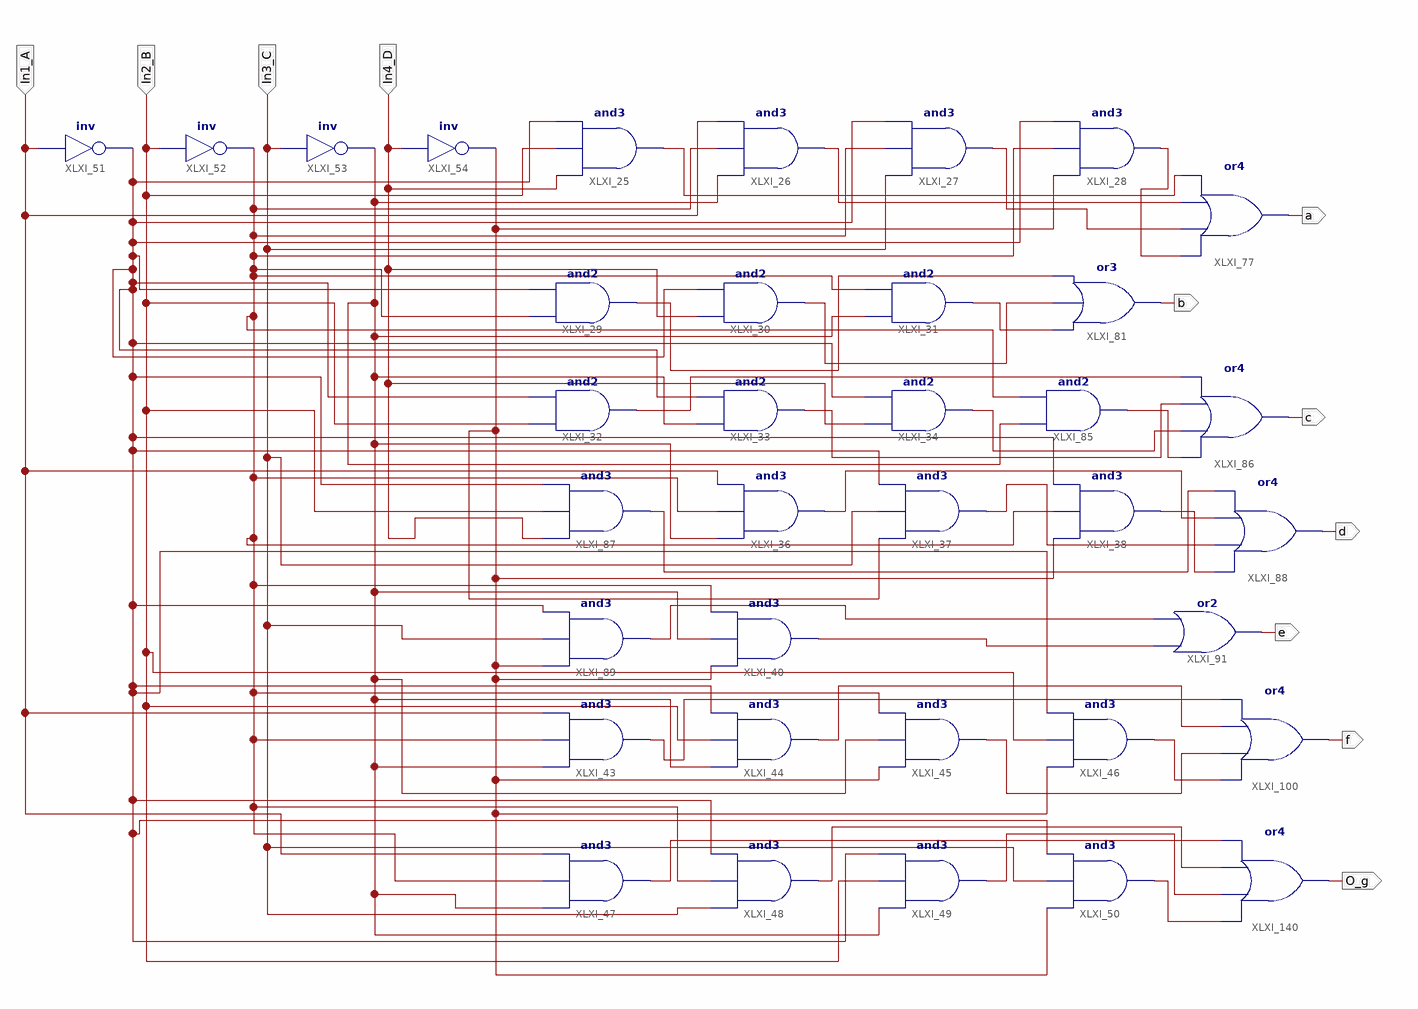
[diagram p0: schematic sheet 1]
// Xilinx ISE schematic Dec_Decoder_7segments.sch (spartan6) as structural Verilog: 36 symbols, 11 ports
module Dec_Decoder_7segments (
  input  In1_A,
  input  In2_B,
  input  In3_C,
  input  In4_D,
  output a,
  output b,
  output c,
  output d,
  output e,
  output f,
  output O_g
);

  wire g, XLXN_31, XLXN_32, XLXN_33, XLXN_34, XLXN_35, XLXN_36, XLXN_38, XLXN_39, XLXN_40, XLXN_41, XLXN_42,
       XLXN_48, XLXN_49, XLXN_50, XLXN_51, XLXN_53, XLXN_55, XLXN_56, XLXN_57, XLXN_60, XLXN_63, XLXN_64,
       XLXN_65, XLXN_66, XLXN_67, XLXN_119, XLXN_120, XLXN_121;

  and XLXI_25 (XLXN_31, In4_D, In2_B, XLXN_57);
  and XLXI_26 (XLXN_32, XLXN_66, XLXN_53, In1_A);
  and XLXI_27 (XLXN_33, In3_C, XLXN_53, XLXN_57);
  and XLXI_28 (XLXN_34, XLXN_67, XLXN_53, XLXN_57);
  not XLXI_51 (XLXN_57, In1_A);
  not XLXI_52 (XLXN_53, In2_B);
  not XLXI_53 (XLXN_66, In3_C);
  not XLXI_54 (XLXN_67, In4_D);
  or XLXI_77 (a, XLXN_34, XLXN_33, XLXN_32, XLXN_31);
  and XLXI_29 (XLXN_35, XLXN_53, XLXN_57);
  and XLXI_30 (XLXN_36, In4_D, XLXN_57);
  and XLXI_31 (XLXN_38, XLXN_66, XLXN_53);
  or XLXI_81 (b, XLXN_38, XLXN_36, XLXN_35);
  and XLXI_32 (XLXN_39, In2_B, XLXN_57);
  and XLXI_33 (XLXN_40, XLXN_66, XLXN_57);
  and XLXI_34 (XLXN_41, In4_D, XLXN_57);
  and XLXI_85 (XLXN_42, XLXN_66, XLXN_53);
  or XLXI_86 (c, XLXN_42, XLXN_41, XLXN_40, XLXN_39);
  and XLXI_36 (XLXN_49, XLXN_66, XLXN_53, In1_A);
  and XLXI_37 (XLXN_50, XLXN_67, In3_C, XLXN_57);
  and XLXI_38 (XLXN_51, XLXN_67, XLXN_53, XLXN_57);
  and XLXI_87 (XLXN_48, In4_D, In2_B, XLXN_57);
  or XLXI_88 (d, XLXN_51, XLXN_50, XLXN_49, XLXN_48);
  and XLXI_89 (XLXN_55, XLXN_67, In3_C, XLXN_57);
  and XLXI_40 (XLXN_56, XLXN_67, XLXN_66, XLXN_53);
  or XLXI_91 (e, XLXN_56, XLXN_55);
  and XLXI_43 (XLXN_60, XLXN_66, XLXN_53, In1_A);
  and XLXI_44 (XLXN_63, XLXN_66, In2_B, XLXN_57);
  and XLXI_45 (XLXN_64, XLXN_67, XLXN_66, XLXN_53);
  and XLXI_46 (XLXN_65, XLXN_67, In2_B, XLXN_57);
  or XLXI_100 (f, XLXN_65, XLXN_64, XLXN_63, XLXN_60);
  and XLXI_47 (XLXN_119, XLXN_66, XLXN_53, In1_A);
  and XLXI_48 (XLXN_120, In3_C, XLXN_53, XLXN_57);
  and XLXI_49 (XLXN_121, XLXN_66, In2_B, XLXN_57);
  and XLXI_50 (g, XLXN_67, In3_C, XLXN_57);
  or XLXI_140 (O_g, g, XLXN_121, XLXN_120, XLXN_119);
endmodule
